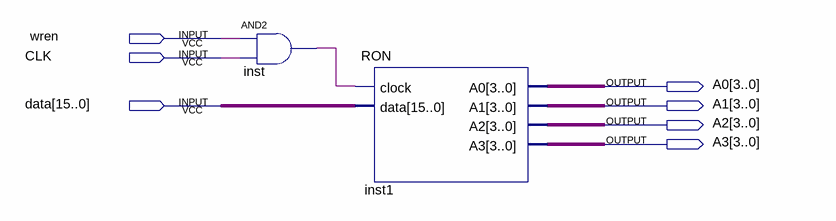
[diagram p0: schematic sheet]
// Quartus schematic RONWren.bdf as structural Verilog: 2 symbols, 7 pins
module RONWren (
  input  wren,
  input  CLK,
  input  [15:0] data,
  output [3:0] A0,
  output [3:0] A1,
  output [3:0] A2,
  output [3:0] A3
);

  wire inst_out;

  and inst (inst_out, wren, CLK);
  RON inst1 (.clock(inst_out), .data(data), .A0(A0), .A1(A1), .A2(A2), .A3(A3));
endmodule
